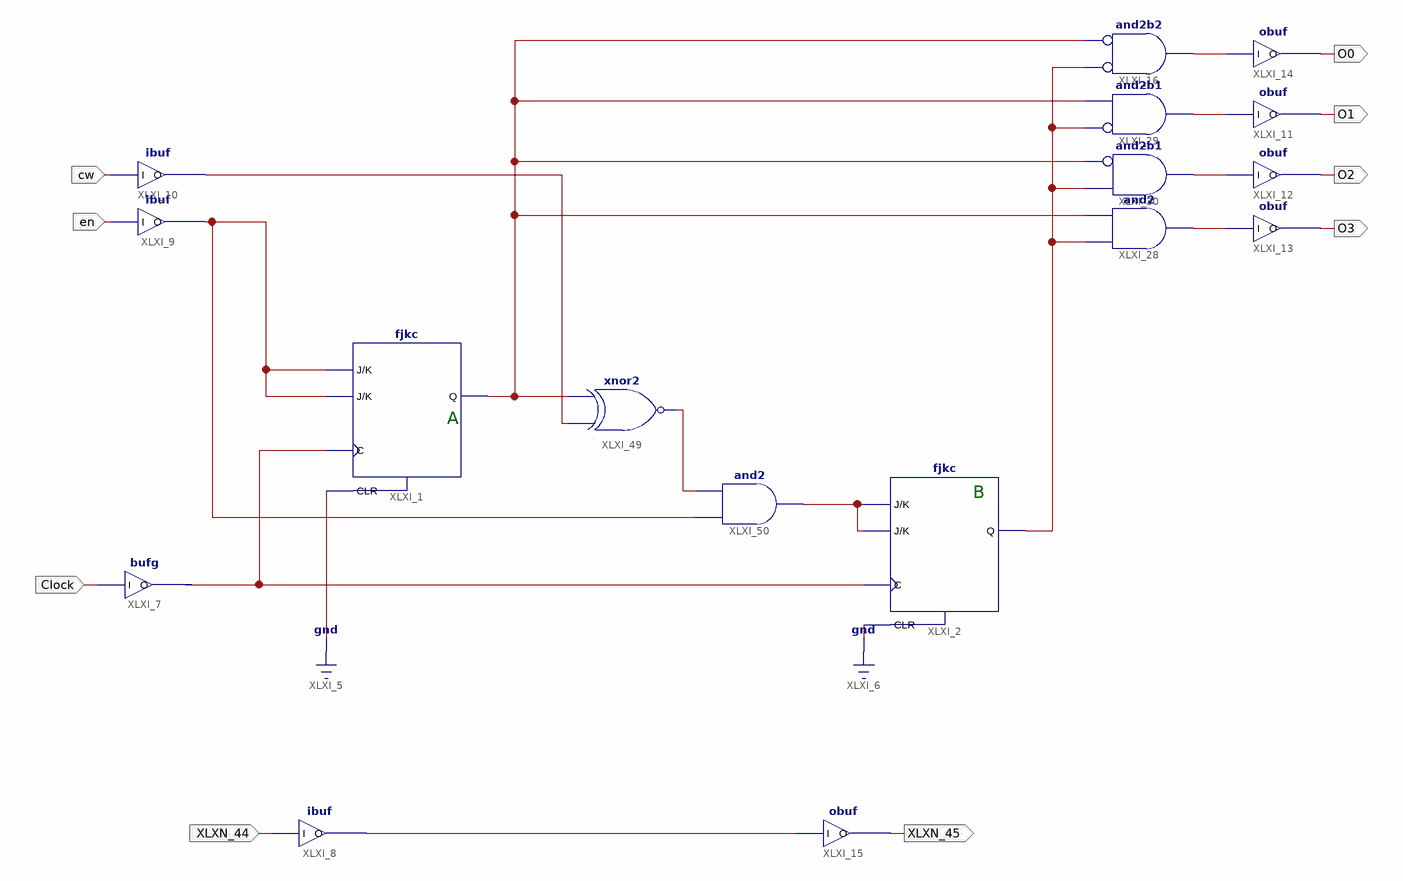
[diagram p0: schematic sheet 1]
// Xilinx ISE schematic TopLevel.sch (xbr) as structural Verilog: 17 symbols, 9 ports
module TopLevel (
  input  en,
  input  cw,
  input  XLXN_44,
  input  Clock,
  output O0,
  output O1,
  output O2,
  output O3,
  output XLXN_45
);

  wire XLXN_2, XLXN_3, XLXN_4, XLXN_5, XLXN_6, XLXN_26, XLXN_37, XLXN_38, XLXN_39, XLXN_40, XLXN_43, XLXN_124;

  obuf XLXI_14 (.I(XLXN_3), .O(O0));
  obuf XLXI_11 (.I(XLXN_4), .O(O1));
  obuf XLXI_12 (.I(XLXN_5), .O(O2));
  obuf XLXI_13 (.I(XLXN_6), .O(O3));
  and XLXI_16 (XLXN_3, ~XLXN_124, ~XLXN_39);  // and2b2
  and XLXI_28 (XLXN_6, XLXN_124, XLXN_39);
  and XLXI_29 (XLXN_4, ~XLXN_124, XLXN_39);  // and2b1
  and XLXI_30 (XLXN_5, ~XLXN_39, XLXN_124);  // and2b1
  ibuf XLXI_8 (.I(XLXN_44), .O(XLXN_2));
  obuf XLXI_15 (.I(XLXN_2), .O(XLXN_45));
  bufg XLXI_7 (.I(Clock), .O(XLXN_26));
  ibuf XLXI_9 (.I(en), .O(XLXN_37));
  ibuf XLXI_10 (.I(cw), .O(XLXN_40));
  fjkc XLXI_2 (.C(XLXN_26), .CLR(1'b0), .J(XLXN_43), .K(XLXN_43), .Q(XLXN_124));
  and XLXI_50 (XLXN_43, XLXN_37, XLXN_38);
  xnor XLXI_49 (XLXN_38, XLXN_40, XLXN_39);
  fjkc XLXI_1 (.C(XLXN_26), .CLR(1'b0), .J(XLXN_37), .K(XLXN_37), .Q(XLXN_39));

  // Notes on the sheet:
  //   A
  //   B
endmodule
